# EAGLE design LB_BIT_p3_USBPOWER-v03(rev1) (EAGLE 6.6.0)
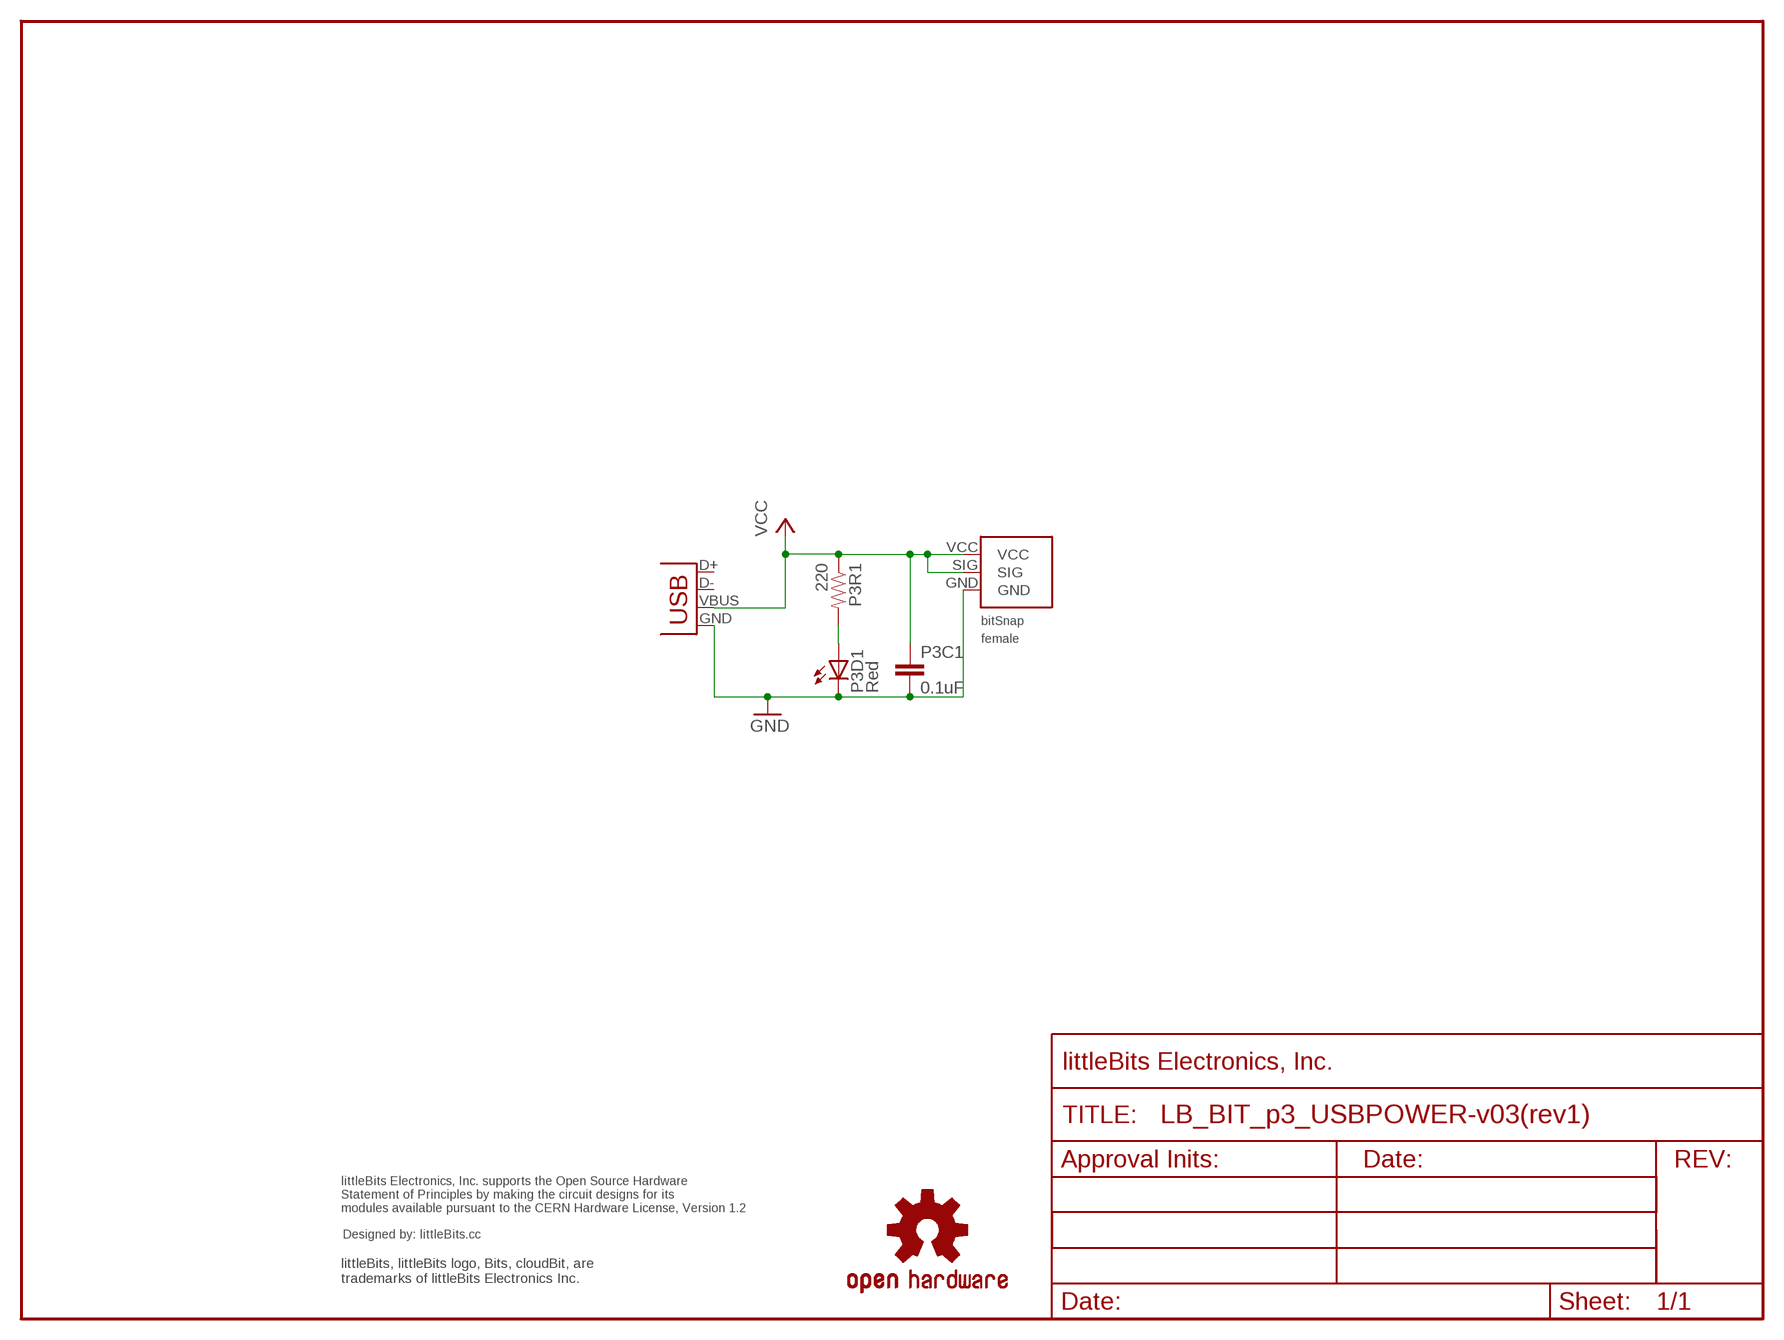
[diagram p0: schematic, sheet 1]

## Parts
P3BSF1  BITSNAP_V03_FEMALE  [BITSNAP_V03_FEMALE]
P3C1  0.1uF  CAP0603-CAP  [0603-CAP]
P3D1  Red  LED1206  [LED-1206]
P3R1  220  RESISTOR0603-RES  [0603-RES]
P3X1  USB-MICROB-AUK_TH  [USB-MICROB-AUK]
U$1  OSHWCREDIT  [OSHWCREDIT]
U$2  FRAME-LETTER-OHWOHW  [FABDWG01-OHW]
U$3  OSHW-LOGOL  [OSHW-LOGO-L]

## Nets
GND: P3BSF1.GND P3C1.2 P3D1.C P3X1.GND
N$1: P3D1.A P3R1.2
VCC: P3BSF1.SIG P3BSF1.VCC P3C1.1 P3R1.1 P3X1.VBUS
Unconnected: P3X1.D+ P3X1.D-

## Library data of the parts
P3BSF1 = bitSnap:BITSNAP_V03_FEMALE
P3C1 = SparkFun:CAP: Capacitor Standard 0603 ceramic capacitor, and 0.1" leaded capacitor.
P3D1 = SparkFun:LED: LEDs Standard schematic elements and footprints for 5mm, 3mm, 1206, and 0603 sized LEDs. 5mm - Spark Fun Electronics SKU : COM-00529 (and others)
P3R1 = SparkFun:RESISTOR: Resistor Basic schematic elements and footprints for 0603, 1206, and PTH 1/10th watt (small) resistors.
P3X1 = LITTLEBITS:USB-MICROB-AUK_TH
U$1 = LITTLEBITS:OSHWCREDIT
U$2 = LITTLEBITS:FRAME-LETTER-OHW
U$3 = SparkFun_NEW:OSHW-LOGO: Open Source Hardware Logo This logo indicates the piece of hardware it is found on incorporates a OSHW license and/or adheres to the definition of open source hardware found here: http://freedomdefined.org/OSHW

## Board
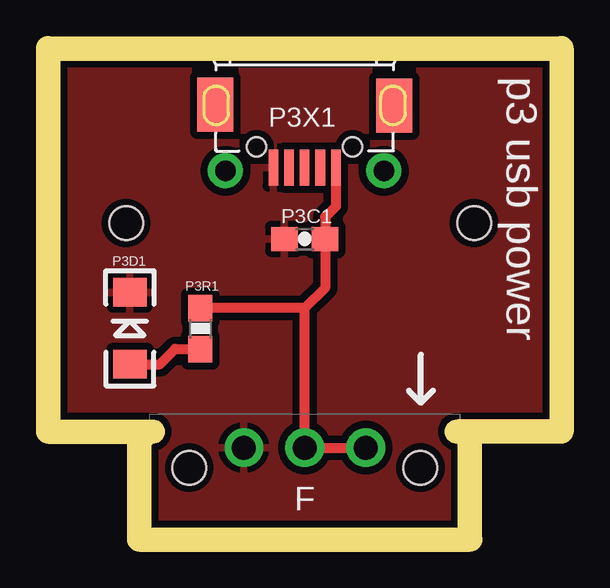
[diagram p1: board, top side]
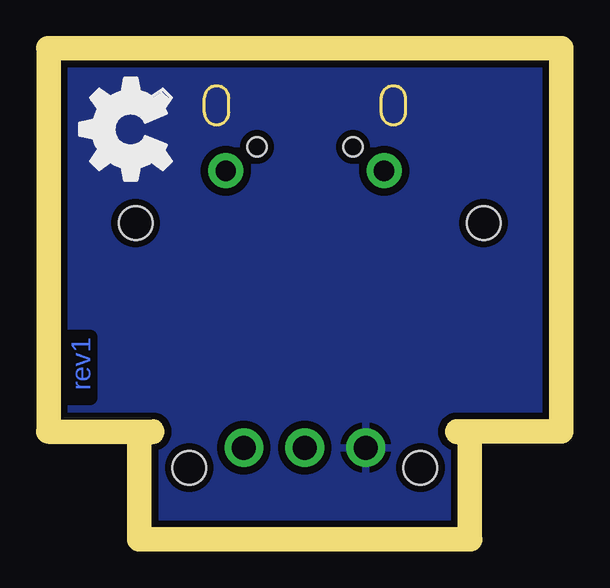
[diagram p2: board, bottom side, seen from below]

Size 20.4 x 19.5 mm. Coordinates in mm from the lower left corner, seen from the top.
Outline: 0,4.5 0,19.5 20.4,19.5 20.4,4.5
Copper layers (1*16): Top 0.035mm / dielectric 1.5mm / Bottom 0.035mm
Design rules "default": minimum track width 8mil, minimum drill 20mil, track to track 8mil, track to pad 8mil, pad to pad 8mil, via to via 8mil, smd to smd 8mil, copper to edge 10mil, drill to drill 8mil, minimum pad ring 12mil, minimum via ring 10mil, stop-mask expansion 4mil, vias tented up to drill 25mil, thermal gap 10mil
Milling: 3 lines

### Footprints (pad centres in the part's own frame; a part is rotated, then mirrored left to right if it is on the bottom)
BITSNAP_V03_FEMALE = drill 1: GND 3.91,3.33; SIG 6.45,3.33; VCC 8.99,3.33 | hole 1.4: 1.63,2.5; 11.27,2.5
0603-CAP = smd 1.1 x 1: 1 -0.85,0; 2 0.85,0
LED-1206 = smd 1.2 x 1.4: A -1.5,0; C 1.5,0
0603-RES = smd 1.1 x 1: 1 -0.85,0; 2 0.85,0
USB-MICROB-AUK = smd 0.4 x 1.5: D+ 0,4.37; D- -0.65,4.37; GND 1.3,4.37; ID 0.65,4.37; VBUS -1.3,4.37 | drill 0.85: P$1 -3.3,4.5; P$2 3.3,4.5 | smd 1.5 x 2.25: P$3 -3.725,1.775; P$4 3.725,1.75 | hole 0.8: -2,3.5; 2,3.5
LB_PWR_LEGS = hole 1.4: 2.75,4.4; 17.25,4.4

### Placement (x,y rotation side)
P3BSF1  3.75,0 0 top
P3C1  10.2,12.03 180 top
P3D1  2.91,8.31 90 top
P3R1  5.85,8.29 270 top
P3X1  10.19,19.38 180 top
U$1  -91.65,-62.35 0 top  (outside the outline)
U$2  0.1,0.15 0 top
U$3  -33,-68.11 0 top  (outside the outline)
U$4  [OSHW_FILLX150_NOTEXT]  15.77,13.65 0 top
U$15  [LB_PWR_LEGS]  0,8.3 0 top

### Tracks (layer width: path | path; a pad name or v marks a point on that pad's centre or on a via)
GND
  pour Top (isolate 0.305): 0.17,19.31 20.2,19.34 20.2,0.17 0.17,0.19
  pour Bottom (isolate 0.305): 0.17,19.31 20.2,19.34 20.2,0.17 0.17,0.2
N$1
  Top 0.406: P3D1.A 4.16,6.81 4.8,7.45 P3R1.2
VCC
  Top 0.406: P3X1.VBUS 11.49,13.39 11.05,12.95 P3C1.1 | P3C1.1 | P3C1.1 11.05,10 10.2,9.15 | 10.2,9.15 P3R1.1 | 10.2,9.15 P3BSF1.SIG P3BSF1.VCC

### Text on the board
Bottom: rev1
tPlace: p3 usb power
Milling: 1mm DIA. ROUTER PATH
dxf: 1 | p3 USB POWER BIT PCB